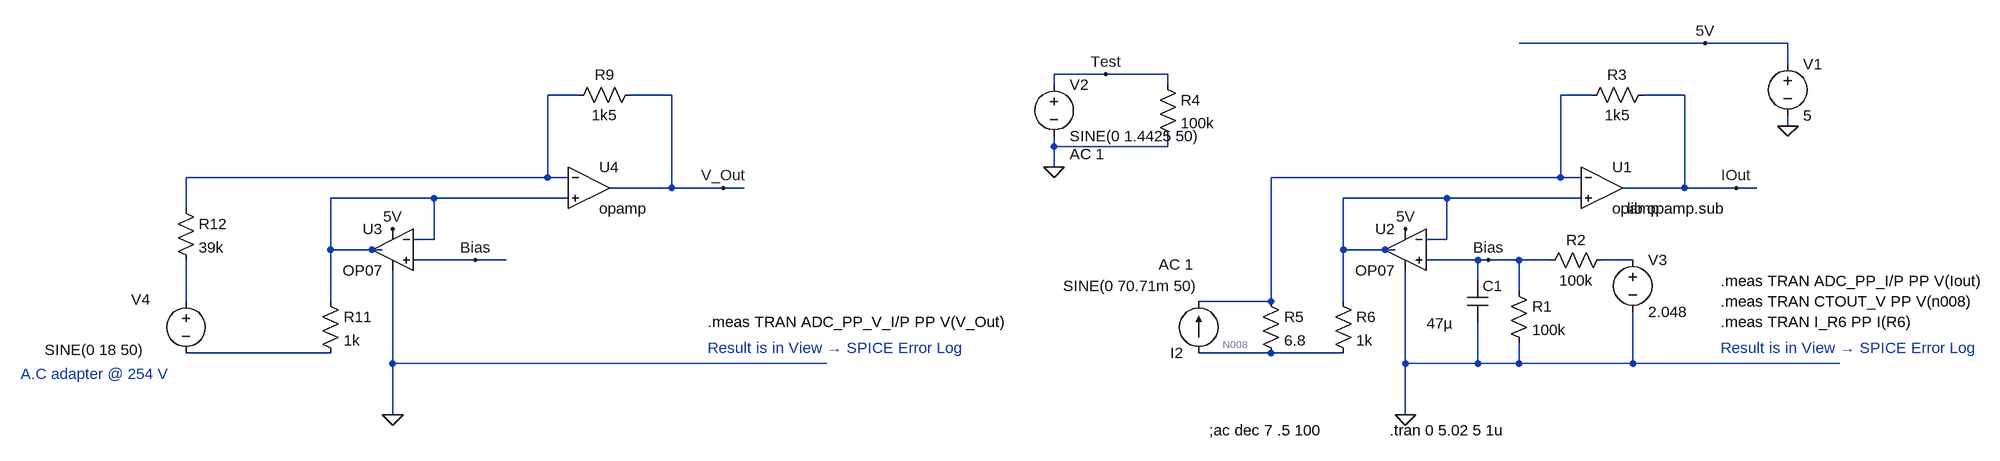
[diagram p0: schematic 50mA_CT_1-ProCent_Bleed_OP07.asc]
50mA_CT_1-ProCent_Bleed_OP07.asc, the LTspice schematic file:
Version 4
SHEET 1 1404 680
WIRE 944 -208 656 -208
WIRE 1072 -208 944 -208
WIRE 1072 -176 1072 -208
WIRE 16 -160 -64 -160
WIRE 112 -160 16 -160
WIRE -64 -144 -64 -160
WIRE 112 -144 112 -160
WIRE -800 -128 -848 -128
WIRE -656 -128 -720 -128
WIRE 768 -128 720 -128
WIRE 912 -128 848 -128
WIRE 1072 -80 1072 -96
WIRE -64 -48 -64 -64
WIRE 112 -48 112 -64
WIRE 112 -48 -64 -48
WIRE -64 -16 -64 -48
WIRE -848 0 -848 -128
WIRE -848 0 -1408 0
WIRE -816 0 -848 0
WIRE 720 0 720 -128
WIRE 720 0 272 0
WIRE 752 0 720 0
WIRE -656 16 -656 -128
WIRE -656 16 -752 16
WIRE -576 16 -656 16
WIRE -544 16 -576 16
WIRE 912 16 912 -128
WIRE 912 16 816 16
WIRE 992 16 912 16
WIRE 1024 16 992 16
WIRE -1024 32 -1184 32
WIRE -816 32 -1024 32
WIRE 544 32 384 32
WIRE 752 32 544 32
WIRE -1408 48 -1408 0
WIRE -1024 96 -1024 32
WIRE -1024 96 -1056 96
WIRE 544 96 544 32
WIRE 544 96 512 96
WIRE -1184 112 -1184 32
WIRE -1120 112 -1184 112
WIRE -1104 112 -1120 112
WIRE 384 112 384 32
WIRE 448 112 384 112
WIRE 464 112 448 112
WIRE -960 128 -1056 128
WIRE -912 128 -960 128
WIRE 592 128 512 128
WIRE 608 128 592 128
WIRE 656 128 608 128
WIRE 704 128 656 128
WIRE 832 128 784 128
WIRE 592 160 592 128
WIRE 656 176 656 128
WIRE -1408 192 -1408 128
WIRE -1184 192 -1184 112
WIRE 272 192 272 0
WIRE 272 192 160 192
WIRE 384 192 384 112
WIRE -1184 272 -1408 272
WIRE 272 272 160 272
WIRE 384 272 272 272
WIRE -1088 288 -1088 144
WIRE -416 288 -1088 288
WIRE 480 288 480 144
WIRE 592 288 592 224
WIRE 592 288 480 288
WIRE 656 288 656 256
WIRE 656 288 592 288
WIRE 832 288 832 208
WIRE 832 288 656 288
WIRE 1152 288 832 288
WIRE -1088 368 -1088 288
WIRE 480 368 480 288
FLAG 480 368 0
FLAG 992 16 IOut
FLAG 1072 -80 0
FLAG 944 -208 5V
FLAG 16 -160 Test
FLAG 480 80 5V
FLAG 608 128 Bias
FLAG -64 -16 0
FLAG -1088 368 0
FLAG -576 16 V_Out
FLAG -1088 80 5V
FLAG -960 128 Bias
SYMBOL res 640 160 R0
SYMATTR InstName R1
SYMATTR Value 100k
SYMBOL res 800 112 R90
WINDOW 0 0 56 VBottom 2
WINDOW 3 32 56 VTop 2
SYMATTR InstName R2
SYMATTR Value 100k
SYMBOL cap 576 160 R0
WINDOW 3 -63 66 Left 2
SYMATTR Value 47µ
SYMATTR InstName C1
SYMBOL res 864 -144 R90
WINDOW 0 0 56 VBottom 2
WINDOW 3 32 56 VTop 2
SYMATTR InstName R3
SYMATTR Value 1k5
SYMBOL voltage 1072 -192 R0
WINDOW 123 0 0 Left 0
WINDOW 39 0 0 Left 0
SYMATTR InstName V1
SYMATTR Value 5
SYMBOL res 96 -160 R0
SYMATTR InstName R4
SYMATTR Value 100k
SYMBOL voltage -64 -160 R0
WINDOW 123 24 124 Left 2
WINDOW 39 0 0 Left 0
SYMATTR Value2 AC 1
SYMATTR InstName V2
SYMATTR Value SINE(0 1.4425 50)
SYMBOL Opamps\\OP07 480 48 M0
SYMATTR InstName U2
SYMBOL current 160 272 R180
WINDOW 3 3 104 Left 2
WINDOW 123 9 137 Left 2
WINDOW 39 0 0 Left 0
SYMATTR Value SINE(0 70.71m 50)
SYMATTR Value2 AC 1
SYMATTR InstName I2
SYMBOL res 256 176 R0
SYMATTR InstName R5
SYMATTR Value 6.8
SYMBOL res 368 176 R0
SYMATTR InstName R6
SYMATTR Value 1k
SYMBOL OpAmps\\opamp 784 -48 R0
SYMATTR InstName U1
SYMBOL res -704 -144 R90
WINDOW 0 0 56 VBottom 2
WINDOW 3 32 56 VTop 2
SYMATTR InstName R9
SYMATTR Value 1k5
SYMBOL Opamps\\OP07 -1088 48 M0
SYMATTR InstName U3
SYMBOL res -1200 176 R0
SYMATTR InstName R11
SYMATTR Value 1k
SYMBOL OpAmps\\opamp -784 -48 R0
SYMATTR InstName U4
SYMBOL res -1424 32 R0
SYMATTR InstName R12
SYMATTR Value 39k
SYMBOL voltage -1408 176 R0
WINDOW 0 -85 13 Left 2
WINDOW 3 -219 91 Left 2
WINDOW 123 0 0 Left 0
WINDOW 39 0 0 Left 0
SYMATTR InstName V4
SYMATTR Value SINE(0 18 50)
SYMBOL voltage 832 112 R0
WINDOW 123 0 0 Left 0
WINDOW 39 0 0 Left 0
SYMATTR InstName V3
SYMATTR Value 2.048
TEXT 456 392 Left 2 !.tran 0 5.02 5 1u
TEXT 176 392 Left 2 !;ac dec 7 .5 100
TEXT 816 48 Left 2 !.lib opamp.sub
TEXT 968 224 Left 2 !.meas TRAN I_R6 PP I(R6)
TEXT 968 264 Left 2 ;Result is in View → SPICE Error Log
TEXT -600 224 Left 2 !.meas TRAN ADC_PP_V_I/P PP V(V_Out)
TEXT -600 264 Left 2 ;Result is in View → SPICE Error Log
TEXT -1664 304 Left 2 ;A.C adapter @ 254 V
TEXT 968 192 Left 2 !.meas TRAN CTOUT_V PP V(n008)
TEXT 968 160 Left 2 !.meas TRAN ADC_PP_I/P PP V(Iout)

The netlist it stands for:
* 50mA_CT_1-ProCent_Bleed_OP07.asc
R1 Bias 0 100k
R2 N005 Bias 100k
C1 Bias 0 47µ
R3 IOut N002 1k5
V1 5V 0 5
R4 Test 0 100k
V2 Test 0 SINE(0 1.4425 50) AC 1
XU2 Bias N004 5V 0 N004 LT1001  ; OP07, pins In+ In- V+ V- OUT
I2 N008 N002 SINE(0 70.71m 50) AC 1
R5 N002 N008 6.8
R6 N004 N008 1k
XU1 N002 N004 IOut opamp Aol=100K GBW=10Meg  ; pins invin noninvin out
R9 V_Out N001 1k5
XU3 Bias N003 5V 0 N003 LT1001  ; OP07, pins In+ In- V+ V- OUT
R11 N003 N007 1k
XU4 N001 N003 V_Out opamp Aol=100K GBW=10Meg  ; pins invin noninvin out
R12 N001 N006 39k
V4 N006 N007 SINE(0 18 50)
V3 N005 0 2.048
.tran 0 5.02 5 1u
;ac dec 7 .5 100
.lib opamp.sub
.meas TRAN I_R6 PP I(R6)
* Result is in View → SPICE Error Log
.meas TRAN ADC_PP_V_I/P PP V(V_Out)
* Result is in View → SPICE Error Log
* A.C adapter @ 254 V
.meas TRAN CTOUT_V PP V(n008)
.meas TRAN ADC_PP_I/P PP V(Iout)
.lib LTC.lib
.backanno
.end